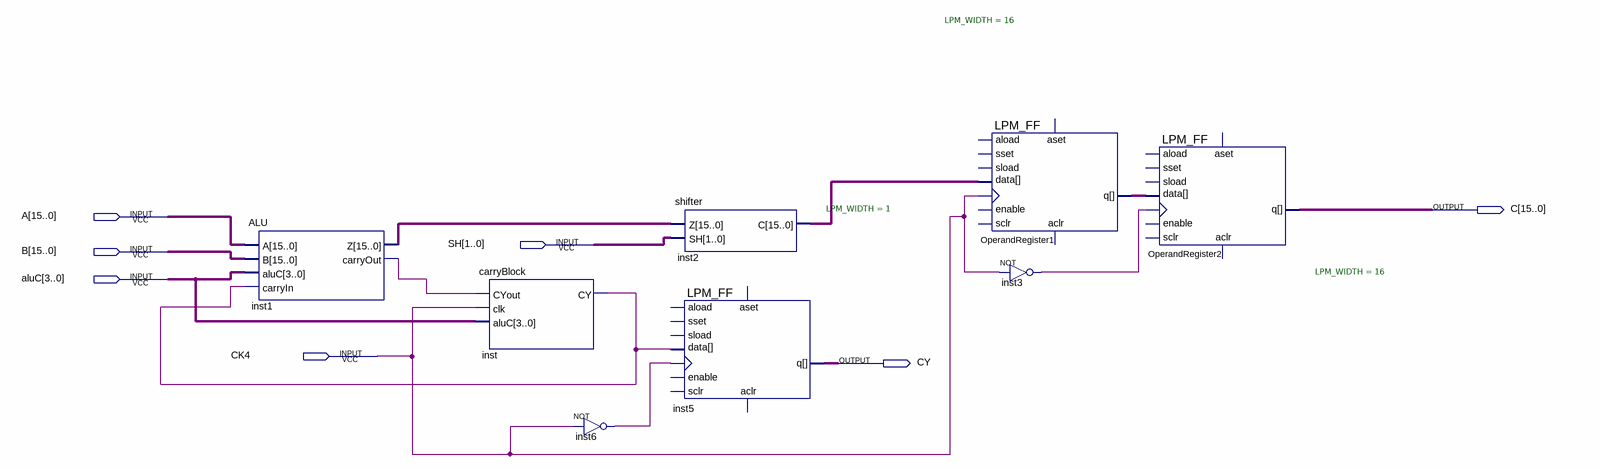
[diagram p0: schematic sheet]
// Quartus schematic ALUUnit.bdf as structural Verilog: 8 symbols, 7 pins
module ALUUnit (
  input  [15:0] A,
  input  [1:0] SH,
  input  [15:0] B,
  input  [3:0] aluC,
  input  CK4,
  output [15:0] C,
  output CY
);

  wire inst1_carryout, inst3_out, inst6_out, inst_cy;
  wire [15:0] inst1_z, inst2_c, OperandRegister1_q;

  ALU inst1 (.A(A), .B(B), .aluC(aluC), .carryIn(inst_cy), .Z(inst1_z), .carryOut(inst1_carryout));
  carryBlock inst (.CYout(inst1_carryout), .clk(CK4), .aluC(aluC), .CY(inst_cy));
  not inst6 (inst6_out, CK4);
  shifter inst2 (.Z(inst1_z), .SH(SH), .C(inst2_c));
  LPM_FF #(.LPM_WIDTH(1)) inst5 (
    .clock(inst6_out), .data(inst_cy), .q(CY));  // open: enable, aload, sset, sload, aset, sclr, aclr
  LPM_FF #(.LPM_WIDTH(16)) OperandRegister1 (
    .clock(CK4), .data(inst2_c), .q(OperandRegister1_q));  // open: enable, aload, sset, sload, aset, sclr, aclr
  not inst3 (inst3_out, CK4);
  LPM_FF #(.LPM_WIDTH(16)) OperandRegister2 (
    .clock(inst3_out), .data(OperandRegister1_q), .q(C));  // open: enable, aload, sset, sload, aset, sclr, aclr
endmodule
